# Altium project 5DPD8_OS.PrjPcb (part 1 of 2)
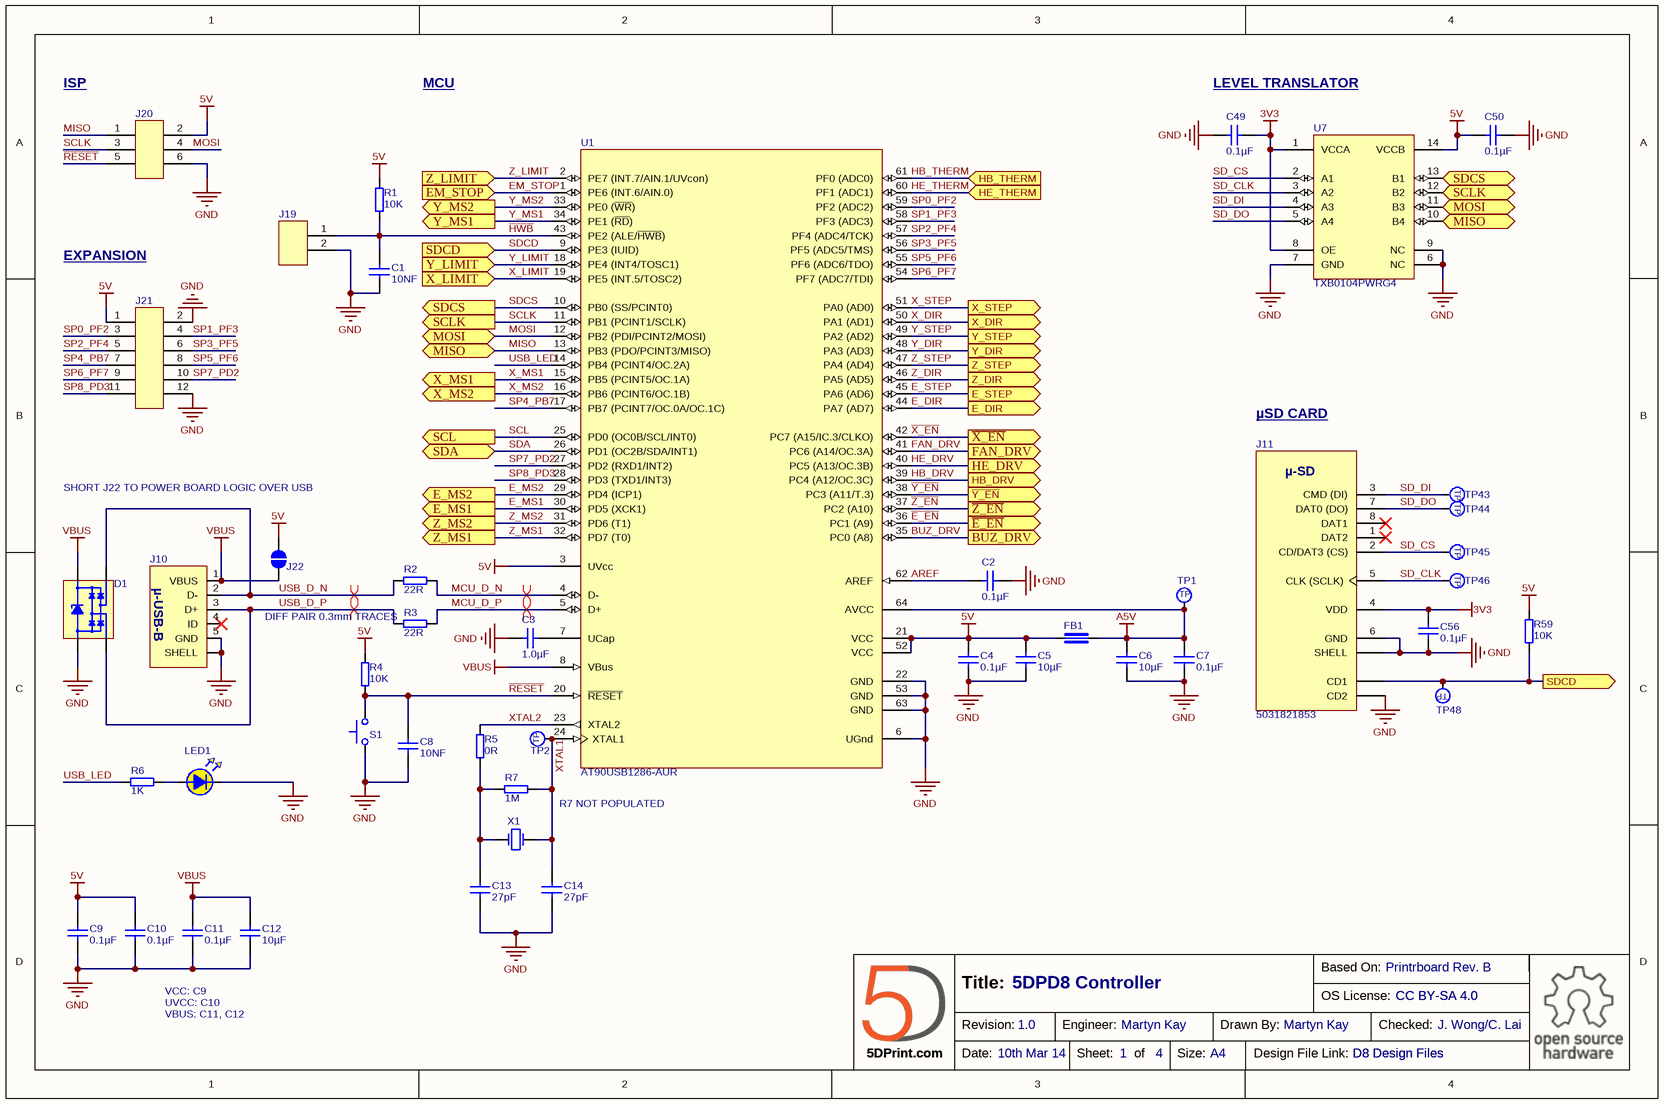
[diagram p0: 5DPD8_v1.0_OS_Sheet1.SchDoc]
4 sheets, 240 parts. Net scope: flat (ports and power ports of the same name join across sheets).
Board file: 5DPD8_v1.0_OS.PcbDoc
Sheets:
  5DPD8_v1.0_OS_Sheet1.SchDoc
  5DPD8_v1.0_OS_Sheet2.SchDoc
  5DPD8_v1.0_OS_Sheet3.SchDoc
  5DPD8_v1.0_OS_Sheet4.SchDoc

## Sheet 5DPD8_v1.0_OS_Sheet1.SchDoc: 5DPD8 Controller
size A4; Date: 10th Mar 14; CheckedBy: J. Wong/C. Lai; CompanyName: Makible Ltd.; DrawnBy: Martyn Kay; Engineer: Martyn Kay; Revision: 1.0; SheetNumber: 1; SheetTotal: 4; Website: 5DPrint.com; DesignFileLink: D8 Design Files; BasedOn: Printrboard Rev. B; OSHWLicense: CC BY-SA 4.0

### Parts
C1  10NF  [CAPC0603(1608)100_N]
C2  0.1µF  [CAPC0603(1608)100_N]
C3  1.0µF  [CAPC0603(1608)100_N]
C4  0.1µF  [CAPC0603(1608)100_N]
C5  10µF  [CAPC0603(1608)100_N]
C6  10µF  [CAPC0603(1608)100_N]
C7  0.1µF  [CAPC0603(1608)100_N]
C8  10NF  [CAPC0603(1608)100_N]
C9  0.1µF  [CAPC0603(1608)100_N]
C10  0.1µF  [CAPC0603(1608)100_N]
C11  0.1µF  [CAPC0603(1608)100_N]
C12  10µF  [CAPC0603(1608)100_N]
C13  27pF  [CAPC0603(1608)100_N]
C14  27pF  [CAPC0603(1608)100_N]
C49  0.1µF  [CAPC0603(1608)100_N]
C50  0.1µF  [CAPC0603(1608)100_N]
C56  0.1µF  [CAPC0603(1608)100_N]
D1  PRTR5V0U2AX,235  [SOT143B(NXP)]  (value not drawn)
FB1  MMZ1608R301A  [INDC0603(1608)_N]  (value not drawn)
J10  10103594-0001LF  [FCI_THT uUSB]  (value not drawn)
J11  5031821853  [MOLEX_503182-1853]
J19  67996-402HLF  [FCI_67996-402HLF]  (value not drawn)
J20  67996-406HLF  [FCI_67996-406HLF]  (value not drawn)
J21  67996-412HLF  [FCI_67996-412HLF]  (value not drawn)
J22  SOLDER JUMPER  [SOLDER_JUMP]  (value not drawn)  (no BOM)
LED1  HSMY-C190  [LEDC0603(1608)_N-YEL]  (value not drawn)
R1  10K  [RESC0603(1608)_N]
R2  22R  [RESC0603(1608)_N]
R3  22R  [RESC0603(1608)_N]
R4  10K  [RESC0603(1608)_N]
R5  0R  [RESC0603(1608)_N]
R6  1K  [RESC0603(1608)_N]
R7  1M  [RESC0603(1608)_N]  (no BOM)
R59  10K  [RESC0603(1608)_N]
S1  PTS810 SJK 250 SMTR LFS  [PTS810]  (value not drawn)
TP1  TESTPOINT  [TESTPOINT]  (value not drawn)  (no BOM)
TP2  TESTPOINT  [TESTPOINT]  (value not drawn)  (no BOM)
TP43  TESTPOINT  [TESTPOINT]  (value not drawn)  (no BOM)
TP44  TESTPOINT  [TESTPOINT]  (value not drawn)  (no BOM)
TP45  TESTPOINT  [TESTPOINT]  (value not drawn)  (no BOM)
TP46  TESTPOINT  [TESTPOINT]  (value not drawn)  (no BOM)
TP48  TESTPOINT  [TESTPOINT]  (value not drawn)  (no BOM)
U1  AT90USB1286-AUR  [QFP80P1600X1600X120-64_N]
U7  TXB0104PWRG4  [TI-PW14_N]
X1  ABLS-16.000MHZ-K4T  [HC-49US]  (value not drawn)

### Ports
BUZ_DRV (out), E_DIR (out), E_MS1 (out), E_MS2 (out), E_STEP (out), EM_STOP (in), FAN_DRV (out), HB_DRV (out), HB_THERM (in), HE_DRV (out), HE_THERM (in), MISO (bidir), MOSI (bidir), SCL (out), SCLK (in), SCLK (out), SDA (bidir), SDCD (in), SDCD (out), SDCS (in), SDCS (out), X_DIR (out), X_LIMIT (in), X_MS1 (out), X_MS2 (out), X_STEP (out), Y_DIR (out), Y_LIMIT (in), Y_MS1 (out), Y_MS2 (out), Y_STEP (out), Z_DIR (out), Z_LIMIT (in), Z_MS1 (out), Z_MS2 (out), Z_STEP (out), ~{E_EN} (out), ~{X_EN} (out), ~{Y_EN} (out), ~{Z_EN} (out)

### Nets
3V3: C49.2 C56.2 J11.4(VDD) U7.1(VCCA) U7.8(OE)
5V: C4.2 C5.2 C9.2 C10.2 C50.1 FB1.1 J20.2 J21.1 J22.2 R1.2 R4.2 R59.2 U1.3(UVcc) U1.21(VCC) U1.52(VCC) U7.14(VCCB)
A5V: C6.2 C7.2 FB1.2 TP1.1 U1.64(AVCC)
GND: C1.1 C2.2 C3.1 C4.1 C5.1 C6.1 C7.1 C8.1 C9.1 C10.1 C11.1 C12.1 C13.1 C14.1 C49.1 C50.2 C56.1 D1.1(GND) J10.5(GND) J10.M(SHELL) J11.6(GND) J11.CD2 J11.M(SHELL) J19.2 J20.6 J21.2 J21.12 LED1.K S1.1 U1.6(UGnd) U1.22(GND) U1.53(GND) U1.63(GND) U7.6(NC) U7.7(GND) U7.9(NC)
VBUS: C11.2 C12.2 D1.4(VBUS) J10.1(VBUS) J22.1 U1.8(VBus)
AREF: C2.1 U1.62(AREF)
BUZ_DRV: U1.35(PC0_(A8)) ; port BUZ_DRV
~{E_EN}: U1.36(PC1_(A9)) ; port ~{E_EN}
E_DIR: U1.44(PA7_(AD7)) ; port E_DIR
E_MS1: U1.30(PD5_(XCK1)) ; port E_MS1
E_MS2: U1.29(PD4_(ICP1)) ; port E_MS2
E_STEP: U1.45(PA6_(AD6)) ; port E_STEP
EM_STOP: U1.1(PE6_(INT.6/AIN.0)) ; port EM_STOP
FAN_DRV: U1.41(PC6_(A14/OC.3A)) ; port FAN_DRV
~{HWB}: C1.2 J19.1 R1.1 U1.43(PE2_(ALE/~{HWB}))
HB_DRV: U1.39(PC4_(A12/OC.3C)) ; port HB_DRV
HB_THERM: U1.61(PF0_(ADC0)) ; port HB_THERM
HE_DRV: U1.40(PC5_(A13/OC.3B)) ; port HE_DRV
HE_THERM: U1.60(PF1_(ADC1)) ; port HE_THERM
MCU_D_N: R2.2 U1.4(D-)
MCU_D_P: R3.2 U1.5(D+)
MISO: J20.1 U1.13(PB3_(PDO/PCINT3/MISO)) U7.10(B4) ; port MISO
MOSI: J20.4 U1.12(PB2_(PDI/PCINT2/MOSI)) U7.11(B3) ; port MOSI
~{RESET}: C8.2 J20.5 R4.1 S1.3 U1.20(~{RESET})
SCL: U1.25(PD0_(OC0B/SCL/INT0)) ; port SCL
SCLK: J20.3 U1.11(PB1_(PCINT1/SCLK)) U7.12(B2) ; port SCLK
SD_CLK: J11.5(CLK_(SCLK)) TP46.1 U7.3(A2)
SD_CS: J11.2(CD/DAT3_(CS)) TP45.1 U7.2(A1)
SD_DI: J11.3(CMD_(DI)) TP43.1 U7.4(A3)
SD_DO: J11.7(DAT0_(DO)) TP44.1 U7.5(A4)
SDA: U1.26(PD1_(OC2B/SDA/INT1)) ; port SDA
SDCD: J11.CD1 R59.1 TP48.1 U1.9(PE3_(IUID)) ; port SDCD
SDCS: U1.10(PB0_(SS/PCINT0)) U7.13(B1) ; port SDCS
SP0_PF2: J21.3 U1.59(PF2_(ADC2))
SP1_PF3: J21.4 U1.58(PF3_(ADC3))
SP2_PF4: J21.5 U1.57(PF4_(ADC4/TCK))
SP3_PF5: J21.6 U1.56(PF5_(ADC5/TMS))
SP4_PB7: J21.7 U1.17(PB7_(PCINT7/OC.0A/OC.1C))
SP5_PF6: J21.8 U1.55(PF6_(ADC6/TDO))
SP6_PF7: J21.9 U1.54(PF7_(ADC7/TDI))
SP7_PD2: J21.10 U1.27(PD2_(RXD1/INT2))
SP8_PD3: J21.11 U1.28(PD3_(TXD1/INT3))
USB_D_N: D1.3(P2) J10.2(D-) R2.1
USB_D_P: D1.2(P1) J10.3(D+) R3.1
USB_LED: R6.1 U1.14(PB4_(PCINT4/OC.2A))
~{X_EN}: U1.42(PC7_(A15/IC.3/CLKO)) ; port ~{X_EN}
X_DIR: U1.50(PA1_(AD1)) ; port X_DIR
X_LIMIT: U1.19(PE5_(INT.5/TOSC2)) ; port X_LIMIT
X_MS1: U1.15(PB5_(PCINT5/OC.1A)) ; port X_MS1
X_MS2: U1.16(PB6_(PCINT6/OC.1B)) ; port X_MS2
X_STEP: U1.51(PA0_(AD0)) ; port X_STEP
XTAL1: C14.2 R7.2 TP2.1 U1.24(XTAL1) X1.2(OSC2)
XTAL2: R5.2 U1.23(XTAL2)
~{Y_EN}: U1.38(PC3_(A11/T.3)) ; port ~{Y_EN}
Y_DIR: U1.48(PA3_(AD3)) ; port Y_DIR
Y_LIMIT: U1.18(PE4_(INT4/TOSC1)) ; port Y_LIMIT
Y_MS1: U1.34(PE1_(~{RD})) ; port Y_MS1
Y_MS2: U1.33(PE0_(~{WR})) ; port Y_MS2
Y_STEP: U1.49(PA2_(AD2)) ; port Y_STEP
~{Z_EN}: U1.37(PC2_(A10)) ; port ~{Z_EN}
Z_DIR: U1.46(PA5_(AD5)) ; port Z_DIR
Z_LIMIT: U1.2(PE7_(INT.7/AIN.1/UVcon)) ; port Z_LIMIT
Z_MS1: U1.32(PD7_(T0)) ; port Z_MS1
Z_MS2: U1.31(PD6_(T1)) ; port Z_MS2
Z_STEP: U1.47(PA4_(AD4)) ; port Z_STEP
NetC3_2: C3.2 U1.7(UCap)
NetC13_2: C13.2 R5.1 R7.1 X1.1(OSC1)
NetLED1_A: LED1.A R6.2

Not connected (* = marked no-connect by the designer): J10 4(ID)*; J11 1(DAT2)* 8(DAT1)*; S1 2 4

### Layout directives
differential pair: MCU_D_N, MCU_D_P, USB_D_N, USB_D_P

### Notes on the sheet
- ISP
- MCU
- LEVEL TRANSLATOR
- EXPANSION
- µSD CARD
- SHORT J22 TO POWER BOARD LOGIC OVER USB
- DIFF PAIR 0.3mm TRACES
- R7 NOT POPULATED
- VCC: C9
  UVCC: C10
  VBUS: C11, C12
- Based On:
- Title:
- Revision:
- Engineer:
- Drawn By:
- OS License:
- Checked:
- Date:
- Sheet:
- of
- Size:
- A4
- Design File Link:
- (in symbol CON_FCI_10103594-0001LF) µ-USB-B
- (in symbol CON_MLX_503182-1853) µ-SD
- (in symbol TESTPOINT) TP

### Library data of the parts
C1 C8 = C0603-10NF-50V-10%-X7R: CAP CER 10000PF 50V 10% X7R 0603; Manufacturer: Yageo; ManufacturerPartNumber: CC0603KPX7R9BB103; Supplier 1: Digi-Key; RoHS: RoHS Compliant; Category: Capacitors; Stock 1: 15000; Pricing 1: 15000=0.003, 30000=0.00285, 75000=0.00255, 105000=0.00206 (USD); Packaging: Tape & Reel (TR); Capacitance: 10NF; Voltage - Rated: 50V; Tolerance: ±10%; Temperature Coefficient: X7R; Mounting Type: Surface Mount, MLCC; Operating Temperature: -55°C ~ 125°C; Applications: General Purpose; Ratings: -; Package / Case: 0603 (1608 Metric); Size / Dimension: 0.063" L x 0.031" W (1.60mm x 0.80mm); Height - Seated (Max): -; Thickness (Max): 0.035" (0.90mm); Lead Spacing: -; Features: -; Lead Style: -; ComponentLink1URL: http://www.yageo.com/documents/recent/UPY-GPHC_X7R_6.3V-to-50V_8.pdf; ComponentLink1Description: http://www.yageo.com/documents/recent/UPY-GPHC_X7R_6.3V-to-50V_8.pdf; Supplier Part Number 1: 311-1572-2-ND
C2 C4 C7 C9-C11 C49 C50 C56 = C0603-0.1UF-50V-10%-X7R: CAP CER 0.1UF 50V 10% X7R 0603; Manufacturer: Yageo; ManufacturerPartNumber: CC0603KRX7R9BB104; Supplier 1: Digi-Key; RoHS: RoHS Compliant; Category: Capacitors; Stock 1: 2096000; Pricing 1: 4000=0.00513, 8000=0.00468, 12000=0.00446, 28000=0.00424, 100000=0.00307 (USD); Packaging: Tape & Reel (TR); Capacitance: 0.1µF; Voltage - Rated: 50V; Tolerance: ±10%; Temperature Coefficient: X7R; Mounting Type: Surface Mount, MLCC; Operating Temperature: -55°C ~ 125°C; Applications: General Purpose; Ratings: -; Package / Case: 0603 (1608 Metric); Size / Dimension: 0.063" L x 0.031" W (1.60mm x 0.80mm); Height - Seated (Max): -; Thickness (Max): 0.035" (0.90mm); Lead Spacing: -; Features: -; Lead Style: -; ComponentLink1URL: http://www.yageo.com/documents/recent/UPY-GPHC_X7R_6.3V-to-50V_8.pdf; ComponentLink1Description: http://www.yageo.com/documents/recent/UPY-GPHC_X7R_6.3V-to-50V_8.pdf; Supplier Part Number 1: 311-1344-2-ND
C3 = C0603-1UF-10V-10%-X7R: CAP CER 1UF 10V 10% X7R 0603; Manufacturer: Taiyo Yuden; ManufacturerPartNumber: LMK107B7105KA-T; Supplier 1: Digi-Key; RoHS: RoHS Compliant; Category: Capacitors; Stock 1: 116000; Pricing 1: 4000=0.00782, 8000=0.00714, 12000=0.0068, 28000=0.00646 (USD); Packaging: Tape & Reel (TR); Capacitance: 1.0µF; Voltage - Rated: 10V; Tolerance: ±10%; Temperature Coefficient: X7R; Mounting Type: Surface Mount, MLCC; Operating Temperature: -55°C ~ 125°C; Applications: General Purpose; Ratings: -; Package / Case: 0603 (1608 Metric); Size / Dimension: 0.063" L x 0.031" W (1.60mm x 0.80mm); Height - Seated (Max): -; Thickness (Max): 0.035" (0.90mm); Lead Spacing: -; Features: -; Lead Style: -; ComponentLink1URL: http://www.yuden.co.jp/or/product/category/capacitor/LMK107B7105KA-T.pdf; ComponentLink1Description: http://www.yuden.co.jp/or/product/category/capacitor/LMK107B7105KA-T.pdf; Supplier Part Number 1: 587-1242-2-ND
C5 C6 C12 = C0603-10UF-10V-10%-X5R: CAP CER 10UF 10V 10% X5R 0603; Manufacturer: TDK Corporation; ManufacturerPartNumber: C1608X5R1A106K080AC; Supplier 1: Digi-Key; RoHS: RoHS Compliant; Category: Capacitors; Stock 1: 316000; Pricing 1: 4000=0.102, 8000=0.096, 12000=0.093, 28000=0.09, 100000=0.078 (USD); Packaging: Tape & Reel (TR); Capacitance: 10µF; Voltage - Rated: 10V; Tolerance: ±10%; Temperature Coefficient: X5R; Mounting Type: Surface Mount, MLCC; Operating Temperature: -55°C ~ 85°C; Applications: General Purpose; Ratings: -; Package / Case: 0603 (1608 Metric); Size / Dimension: 0.063" L x 0.031" W (1.60mm x 0.80mm); Height - Seated (Max): -; Thickness (Max): 0.035" (0.90mm); Lead Spacing: -; Features: -; Lead Style: -; ComponentLink1URL: http://product.tdk.com/capacitor/mlcc/en/documents/mlcc_commercial_general_en.pdf; ComponentLink1Description: http://product.tdk.com/capacitor/mlcc/en/documents/mlcc_commercial_general_en.pdf; Supplier Part Number 1: 445-7486-2-ND
C13 C14 = C0603-27PF-50V-1%-NP0: CAP CER 27PF 50V 1% NP0 0603; Manufacturer: Murata Electronics North America; ManufacturerPartNumber: GRM1885C1H270FA01D; Temperature Coefficient: C0G, NP0; Supplier 1: Digi-Key; RoHS: RoHS Compliant; Category: Capacitors; Stock 1: 0; Pricing 1: 16000=0.02109 (USD); Packaging: Tape & Reel (TR); Capacitance: 27pF; Voltage - Rated: 50V; Tolerance: ±1%; Mounting Type: Surface Mount, MLCC; Operating Temperature: -55°C ~ 125°C; Applications: General Purpose; Ratings: -; Package / Case: 0603 (1608 Metric); Size / Dimension: 0.063" L x 0.031" W (1.60mm x 0.80mm); Height - Seated (Max): -; Thickness (Max): 0.035" (0.90mm); Lead Spacing: -; Features: -; Lead Style: -; ComponentLink1URL: http://www.murata.com/products/catalog/pdf/c02e.pdf; ComponentLink1Description: http://www.murata.com/products/catalog/pdf/c02e.pdf; Supplier Part Number 1: GRM1885C1H270FA01D-ND
D1 = DIO_PRTR5V0U2AX,235: DIODE ESD PROTECT 5.5V SOT143B; Manufacturer: NXP Semiconductors; Voltage - Breakdown: 6V; Polarization: 2 Channel Array - Bidirectional; Supplier 1: Digi-Key; ManufacturerPartNumber: PRTR5V0U2AX,235; RoHS: RoHS Compliant; Category: Circuit Protection; Stock 1: 0; Pricing 1: 10000=0.15876, 30000=0.15053, 50000=0.147, 100000=0.14465, 250000=0.14112 (USD); Packaging: Tape & Reel (TR); Voltage - Reverse Standoff (Typ): 5.5V; Power (Watts): -; Mounting Type: Surface Mount; Package / Case: TO-253-4, TO-253AA; Supplier Device Package: SOT-143B; ComponentLink1URL: http://www.nxp.com/documents/data_sheet/PRTR5V0U2AX.pdf; ComponentLink1Description: http://www.nxp.com/documents/data_sheet/PRTR5V0U2AX.pdf; Supplier Part Number 1: 568-7445-2-ND
FB1 = MAG_MMZ1608R301A: FERRITE CHIP 300 OHM 500MA 0603; Manufacturer: TDK Corporation; Impedance @ Frequency: 300 Ohm @ 100MHz; DC Resistance (DCR): 250 mOhm Max; Filter Type: Differential Mode - Single; Supplier 1: Digi-Key; ManufacturerPartNumber: MMZ1608R301A; RoHS: RoHS Compliant; Category: Filters; Stock 1: 176000; Pricing 1: 4000=0.0192, 8000=0.0174, 12000=0.0168, 28000=0.0156, 100000=0.01542 (USD); Packaging: Tape & Reel (TR); Current Rating: 500mA; Package / Case: 0603 (1608 Metric); Mounting Type: Surface Mount; Height (Max): 0.037" (0.95mm); Size / Dimension: 0.063" L x 0.031" W (1.60mm x 0.80mm); ComponentLink1URL: http://www.tdk.co.jp/tefe02/e9412_mmz.pdf; ComponentLink1Description: http://www.tdk.co.jp/tefe02/e9412_mmz.pdf; Supplier Part Number 1: 445-2171-2-ND
J10 = CON_FCI_10103594-0001LF: CONN RCPT STD MICRO USB TYPE B; Manufacturer: FCI; Connector Type: USB - micro B; Number of Contacts: 5; Gender: Receptacle; Specifications: USB 2.0; Supplier 1: Digi-Key; ManufacturerPartNumber: 10103594-0001LF; RoHS: RoHS Compliant; Category: Connectors, Interconnects; Stock 1: 6000; Pricing 1: 1500=0.32896, 3000=0.3084, 7500=0.29812, 10500=0.27756, 15000=0.27345, 37500=0.26728 (USD); Packaging: Tape & Reel (TR); Mounting Type: Surface Mount, Right Angle, Horizontal; Features: Shielded, Solder Retention; Ingress Protection: -; ComponentLink1URL: http://portal.fciconnect.com/Comergent//fci/drawing/10103594.pdf; ComponentLink1Description: http://portal.fciconnect.com/Comergent//fci/drawing/10103594.pdf; Supplier Part Number 1: 609-4050-2-ND
J11 = CON_MLX_503182-1853: CONN MICRO SD MEMORY CARD 8CKT; Manufacturer: Molex Inc; Card Type: Secure Digital - microSD™; Number of Positions: 10 (8 + 2); Connector Type: Connector and Ejector; Insertion, Removal Method: Push In, Push Out; Supplier 1: Digi-Key; ManufacturerPartNumber: 5031821853; RoHS: RoHS Compliant; Category: Connectors, Interconnects; Stock 1: 0; Pricing 1: 1600=0.90074, 3200=0.86968, 4800=0.8262, 8000=0.80756 (USD); Packaging: Tape & Reel (TR); Ejector Side: -; Mounting Type: Surface Mount, Right Angle; Features: Switch; Height Above Board: 0.057" (1.45mm); Mounting Feature: Normal, Standard - Top; Contact Finish: Gold; Contact Finish Thickness: -; ComponentLink1URL: http://www.molex.com/pdm_docs/sd/5031821853_sd.pdf; ComponentLink1Description: http://www.molex.com/pdm_docs/sd/5031821853_sd.pdf; Supplier Part Number 1: WM9750TR-ND
J19 = CON_FCI_67996-402HLF: CONN HEADER 2POS .100 STR TIN; Manufacturer: FCI; Current Rating: 3 A; Mounting Angle: Vertical; Voltage Rating: 1.5 kV; Pitch: 2.54 mm; Insulation Resistance: 5000 MOhms; Mating Post Length: 5.84 mm; Number of Positions / Contacts: 2; Supplier 1: Mouser; ManufacturerPartNumber: 67996-402HLF; RoHS: RoHS Compliant; Category: Headers & Wire Housings; Stock 1: 3589; Pricing 1: 1=0.120, 10=0.092, 100=0.077, 500=0.064, 1000=0.055, 2500=0.049, 5000=0.048, 10000=0.047 (USD); Contact Plating: Tin; Housing Material: Thermoplastic; Number of Rows: 2; Packaging: Bulk; Series: BergStik; Termination Style: Through Hole; Type: Unshrouded; Contact Material: Phosphor Bronze; Mounting Style: -; Row Spacing: 2.54 mm; Contact Gender: Pin (Male); Product Category: Bergstik Headers; Product Type: Headers; Standard Pack Qty: 2000; Termination Post Length: 2.41 mm; RoHS - Mouser: Y; Minimum Order Quantity: 1; Reeling: False; ComponentLink1URL: http://portal.fciconnect.com/Comergent/fci/drawing/67996.pdf; ComponentLink1Description: http://portal.fciconnect.com/Comergent/fci/drawing/67996.pdf; Supplier Part Number 1: 649-67996-402HLF
J20 = CON_FCI_67996-406HLF: CONN HEADER 6POS .100 STR TIN; Manufacturer: FCI; Connector Type: Header, Unshrouded; Number of Positions: 6; Number of Positions Loaded: All; Pitch: 0.100" (2.54mm); Supplier 1: Digi-Key; ManufacturerPartNumber: 67996-406HLF; RoHS: RoHS Compliant; Category: Connectors, Interconnects; Stock 1: 6000; Pricing 1: 1=0.26, 10=0.249, 25=0.2132, 50=0.1814, 100=0.1742, 250=0.15644, 500=0.14932, 1000=0.12443, 2500=0.11376 (USD); Packaging: Bulk; Contact Type: Male Pin; Number of Rows: 2; Row Spacing: 0.100" (2.54mm); Contact Mating Length: 0.230" (5.84mm); Mounting Type: Through Hole; Termination: Solder; Fastening Type: -; Features: -; Contact Finish: Tin; Contact Finish Thickness: 100µin (2.54µm); Color: Black; ComponentLink1URL: http://portal.fciconnect.com/Comergent//fci/drawing/67996.pdf; ComponentLink1Description: http://portal.fciconnect.com/Comergent//fci/drawing/67996.pdf; Supplier Part Number 1: 609-3218-ND
J21 = CON_FCI_67996-412HLF: CONN HEADER 12POS .100 STR TIN; Manufacturer: FCI; Connector Type: Header, Unshrouded; Number of Positions: 12; Number of Positions Loaded: All; Pitch: 0.100" (2.54mm); Supplier 1: Digi-Key; ManufacturerPartNumber: 67996-412HLF; RoHS: RoHS Compliant; Category: Connectors, Interconnects; Stock 1: 1651; Pricing 1: 1=0.4, 10=0.379, 25=0.3248, 50=0.276, 100=0.2651, 250=0.23804, 500=0.22722, 1000=0.18935, 2500=0.17312 (USD); Packaging: Bulk; Contact Type: Male Pin; Number of Rows: 2; Row Spacing: 0.100" (2.54mm); Contact Mating Length: 0.230" (5.84mm); Mounting Type: Through Hole; Termination: Solder; Fastening Type: -; Features: -; Contact Finish: Tin; Contact Finish Thickness: 100µin (2.54µm); Color: Black; ComponentLink1URL: http://portal.fciconnect.com/Comergent//fci/drawing/67996.pdf; ComponentLink1Description: http://portal.fciconnect.com/Comergent//fci/drawing/67996.pdf; Supplier Part Number 1: 609-3219-ND
J22 = CON_SOLDER_JUMP
LED1 = LED_HSMY-C190: LED 589NM YELLOW DIFF 0603 SMD; Manufacturer: Avago Technologies US Inc.; Wavelength - Dominant: 586nm; Millicandela Rating: 8mcd; Voltage - Forward (Vf) Typ: 2.1V; Current - Test: 20mA; Viewing Angle: 170°; Lens Type: Diffused; Lens Style/Size: Rectangle with Flat Top, 1mm x 0.8mm; Supplier 1: Digi-Key; ManufacturerPartNumber: HSMY-C190; RoHS: RoHS Compliant; Category: Optoelectronics; Stock 1: 12000; Pricing 1: 4000=0.08, 8000=0.072, 12000=0.064, 28000=0.06, 100000=0.052 (USD); Packaging: Tape & Reel (TR); Color: Yellow; Wavelength - Peak: 589nm; Package / Case: 0603 (1608 Metric); Size / Dimension: 1.60mm L x 0.80mm W; Height: 0.80mm; Mounting Type: Surface Mount; Luminous Flux @ Current - Test: -; ComponentLink1URL: http://www.avagotech.com/docs/AV02-0551EN; ComponentLink1Description: http://www.avagotech.com/docs/AV02-0551EN; Supplier Part Number 1: 516-1424-2-ND
R1 R4 R59 = R0603-10K-0.1W-5%: RES 10K OHM 1/10W 5% 0603 SMD; Manufacturer: Yageo; ManufacturerPartNumber: RC0603JR-0710KL; Power (Watts): 0.1W, 1/10W; Temperature Coefficient: ±100ppm/°C; Supplier 1: Digi-Key; RoHS: RoHS Compliant; Category: Resistors; Stock 1: 0; Pricing 1: 5000=0.00131, 10000=0.00114, 25000=0.001, 50000=0.00092, 125000=0.0009 (USD); Packaging: Tape & Reel (TR); Resistance: 10K; Tolerance: ±5%; Composition: Thick Film; Features: -; Package / Case: 0603 (1608 Metric); Supplier Device Package: 0603; Size / Dimension: 0.063" L x 0.031" W (1.60mm x 0.80mm); Height: 0.022" (0.55mm); Number of Terminations: 2; ComponentLink1URL: http://www.yageo.com/documents/recent/PYu-RC0603_51_RoHS_L_4.pdf; ComponentLink1Description: http://www.yageo.com/documents/recent/PYu-RC0603_51_RoHS_L_4.pdf; Supplier Part Number 1: 311-10KGRTR-ND
R2 R3 = R0603-22R-0.1W-1%: RES 22.0 OHM 1/10W 1% 0603 SMD; Manufacturer: Yageo; ManufacturerPartNumber: RC0603FR-0722RL; Power (Watts): 0.1W, 1/10W; Temperature Coefficient: ±100ppm/°C; Supplier 1: Digi-Key; RoHS: RoHS Compliant; Category: Resistors; Stock 1: 45000; Pricing 1: 5000=0.00171, 10000=0.00149, 25000=0.00131, 50000=0.0012, 125000=0.00117 (USD); Packaging: Tape & Reel (TR); Resistance: 22R; Tolerance: ±1%; Composition: Thick Film; Features: -; Package / Case: 0603 (1608 Metric); Supplier Device Package: 0603; Size / Dimension: 0.063" L x 0.031" W (1.60mm x 0.80mm); Height: 0.022" (0.55mm); Number of Terminations: 2; ComponentLink1URL: http://www.yageo.com/documents/recent/PYu-RC0603_51_RoHS_L_4.pdf; ComponentLink1Description: http://www.yageo.com/documents/recent/PYu-RC0603_51_RoHS_L_4.pdf; Supplier Part Number 1: 311-22.0HRTR-ND
R5 = R0603-0R-0.1W-JUMP: RES ZERO OHM 1/10W JUMP 0603 SMD; Manufacturer: Yageo; ManufacturerPartNumber: RC0603JR-070RL; Tolerance: Jumper; Power (Watts): 0.1W, 1/10W; Supplier 1: Digi-Key; RoHS: RoHS Compliant; Category: Resistors; Stock 1: 2065000; Pricing 1: 5000=0.00131, 10000=0.00114, 25000=0.001, 50000=0.00092, 125000=0.0009 (USD); Packaging: Tape & Reel (TR); Resistance: 0R; Composition: Thick Film; Features: -; Temperature Coefficient: -; Package / Case: 0603 (1608 Metric); Supplier Device Package: 0603; Size / Dimension: 0.063" L x 0.031" W (1.60mm x 0.80mm); Height: 0.022" (0.55mm); Number of Terminations: 2; ComponentLink1URL: http://www.yageo.com/documents/recent/PYu-RC0603_51_RoHS_L_4.pdf; ComponentLink1Description: http://www.yageo.com/documents/recent/PYu-RC0603_51_RoHS_L_4.pdf; Supplier Part Number 1: 311-0.0GRTR-ND
R6 = R0603-1K-0.1W-1%: RES 1.00K OHM 1/10W 1% 0603 SMD; Manufacturer: Yageo; ManufacturerPartNumber: RC0603FR-071KL; Power (Watts): 0.1W, 1/10W; Temperature Coefficient: ±100ppm/°C; Supplier 1: Digi-Key; RoHS: RoHS Compliant; Category: Resistors; Stock 1: 1620000; Pricing 1: 5000=0.00171, 10000=0.00149, 25000=0.00131, 50000=0.0012, 125000=0.00117 (USD); Packaging: Tape & Reel (TR); Resistance: 1K; Tolerance: ±1%; Composition: Thick Film; Features: -; Package / Case: 0603 (1608 Metric); Supplier Device Package: 0603; Size / Dimension: 0.063" L x 0.031" W (1.60mm x 0.80mm); Height: 0.022" (0.55mm); Number of Terminations: 2; ComponentLink1URL: http://www.yageo.com/documents/recent/PYu-RC0603_51_RoHS_L_4.pdf; ComponentLink1Description: http://www.yageo.com/documents/recent/PYu-RC0603_51_RoHS_L_4.pdf; Supplier Part Number 1: 311-1.00KHRTR-ND
R7 = R0603-1M-0.1W-1%: RES 1.00M OHM 1/10W 1% 0603 SMD; Manufacturer: Yageo; ManufacturerPartNumber: RC0603FR-071ML; Power (Watts): 0.1W, 1/10W; Temperature Coefficient: ±100ppm/°C; Supplier 1: Digi-Key; RoHS: RoHS Compliant; Category: Resistors; Stock 1: 1300000; Pricing 1: 5000=0.00171, 10000=0.00149, 25000=0.00131, 50000=0.0012, 125000=0.00117 (USD); Packaging: Tape & Reel (TR); Resistance: 1M; Tolerance: ±1%; Composition: Thick Film; Features: -; Package / Case: 0603 (1608 Metric); Supplier Device Package: 0603; Size / Dimension: 0.063" L x 0.031" W (1.60mm x 0.80mm); Height: 0.022" (0.55mm); Number of Terminations: 2; ComponentLink1URL: http://www.yageo.com/documents/recent/PYu-RC0603_51_RoHS_L_4.pdf; ComponentLink1Description: http://www.yageo.com/documents/recent/PYu-RC0603_51_RoHS_L_4.pdf; Supplier Part Number 1: 311-1.00MHRTR-ND
S1 = SW_PTS810 SJK 250 SMTR LFS: SWITCH TACTILE SPST-NO 0.05A 16V; Manufacturer: C&K Components; Switch Function: Off-Mom; Contact Rating @ Voltage: 0.05A @ 16VDC; Actuator Type: Standard; Actuator Height off PCB, from Pins: 2.50mm; Actuator Orientation: Top Actuated; Outline: 4.20mm x 3.20mm; Illumination: Non-Illuminated; Operating Force: 260gf; Switch Travel: 0.15mm; Mechanical Life: 50,000 Cycles; Supplier 1: Digi-Key; ManufacturerPartNumber: PTS810 SJK 250 SMTR LFS; RoHS: RoHS Compliant; Category: Switches; Stock 1: 14500; Pricing 1: 2900=0.147, 5800=0.1218 (USD); Packaging: Tape & Reel (TR); Circuit: SPST-NO; Mounting Type: Surface Mount; Termination Style: J Lead; Illumination Voltage (Nominal): -; Illumination Type, Color: -; Ingress Protection: -; Features: -; Actuator Material: -; Operating Temperature: -40°C ~ 85°C; ComponentLink1URL: http://www.ck-components.com/80183/pts810_4mar13.pdf/; ComponentLink1Description: http://www.ck-components.com/80183/pts810_4mar13.pdf/; Supplier Part Number 1: CKN10503TR-ND
U1 = IC_AT90USB1286-AUR: IC MCU 8BIT 128KB FLASH 64TQFP; Manufacturer: Atmel; Core Processor: AVR; Core Size: 8-Bit; Speed: 16MHz; Connectivity: EBI/EMI, I²C, SPI, UART/USART, USB, USB OTG; Peripherals: Brown-out Detect/Reset, POR, PWM, WDT; Number of I /O: 48; Program Memory Size: 128KB (128K x 8); EEPROM Size: 4K x 8; RAM Size: 8K x 8; Voltage - Supply (Vcc/Vdd): 2.7 V ~ 5.5 V; Data Converters: A/D 8x10b; Oscillator Type: Internal; Supplier 1: Digi-Key; ManufacturerPartNumber: AT90USB1286-AUR; RoHS: RoHS Compliant; Category: Integrated Circuits (ICs); Stock 1: 0; Pricing 1: 1000=6.295 (USD); Packaging: Tape & Reel (TR); Program Memory Type: FLASH; Operating Temperature: -40°C ~ 85°C; Package / Case: 64-TQFP; ComponentLink1URL: http://www.atmel.com/Images/7593S.pdf; ComponentLink1Description: http://www.atmel.com/Images/7593S.pdf; Supplier Part Number 1: AT90USB1286-AURTR-ND
U7 = IC_TXB0104PWRG4: IC VOLT-LEVEL TRANSLATOR 14TSSOP; Manufacturer: Texas Instruments; Logic Function: Translator, Bidirectional; Number of Bits: 4; Input Type: Logic; Data Rate: 100Mbps; Number of Outputs/Channel: 1; Differential - Input:Output: No/No; Propagation Delay (Max): 4ns; Voltage - Supply: 1.2 V ~ 3.6 V, 1.65 V ~ 5.5 V; Supplier 1: Digi-Key; ManufacturerPartNumber: TXB0104PWRG4; RoHS: RoHS Compliant; Category: Integrated Circuits (ICs); Stock 1: 0; Pricing 1: 2000=0.6552 (USD); Packaging: Tape & Reel (TR); Output Type: Logic; Number of Channels: 4; Operating Temperature: -40°C ~ 85°C; Package / Case: 14-TSSOP (0.173", 4.40mm Width); Supplier Device Package: 14-TSSOP; Mounting Type: Surface Mount; ComponentLink1URL: http://www.ti.com/lit/ds/symlink/txb0104.pdf; ComponentLink1Description: http://www.ti.com/lit/ds/symlink/txb0104.pdf; Supplier Part Number 1: TXB0104PWRG4-ND
X1 = XTAL_ABLS-16.000MHZ-K4T: CRYSTAL 16MHZ 18PF SMD; Manufacturer: Abracon Corporation; Frequency Stability: ±50ppm; Frequency Tolerance: ±30ppm; ESR (Equivalent Series Resistance): 40 Ohm; Operating Mode: Fundamental; Supplier 1: Digi-Key; ManufacturerPartNumber: ABLS-16.000MHZ-K4T; RoHS: RoHS Compliant; Category: Crystals and Oscillators; Stock 1: 11000; Pricing 1: 1000=0.378, 3000=0.3645, 5000=0.351, 10000=0.3375, 25000=0.324 (USD); Packaging: Tape & Reel (TR); Type: MHz Crystal; Frequency: 16MHz; Load Capacitance: 18pF; Operating Temperature: -40°C ~ 125°C; Ratings: -; Mounting Type: Surface Mount; Package / Case: HC49/US; Size / Dimension: 0.449" L x 0.185" W (11.40mm x 4.70mm); Height: 0.165" (4.20mm); ComponentLink1URL: http://www.abracon.com/Resonators/abls.pdf; ComponentLink1Description: http://www.abracon.com/Resonators/abls.pdf; Supplier Part Number 1: 535-9948-2-ND

## Sheet 5DPD8_v1.0_OS_Sheet2.SchDoc: 5DPD8 Controller
size A4; Date: 10th Mar 14; CheckedBy: J. Wong/C. Lai; CompanyName: Makible Ltd.; DrawnBy: Martyn Kay; Engineer: Martyn Kay; Revision: 1.0; SheetNumber: 2; SheetTotal: 4; Website: 5DPrint.com; DesignFileLink: D8 Design Files; BasedOn: Printrboard Rev. B; OSHWLicense: CC BY-SA 4.0
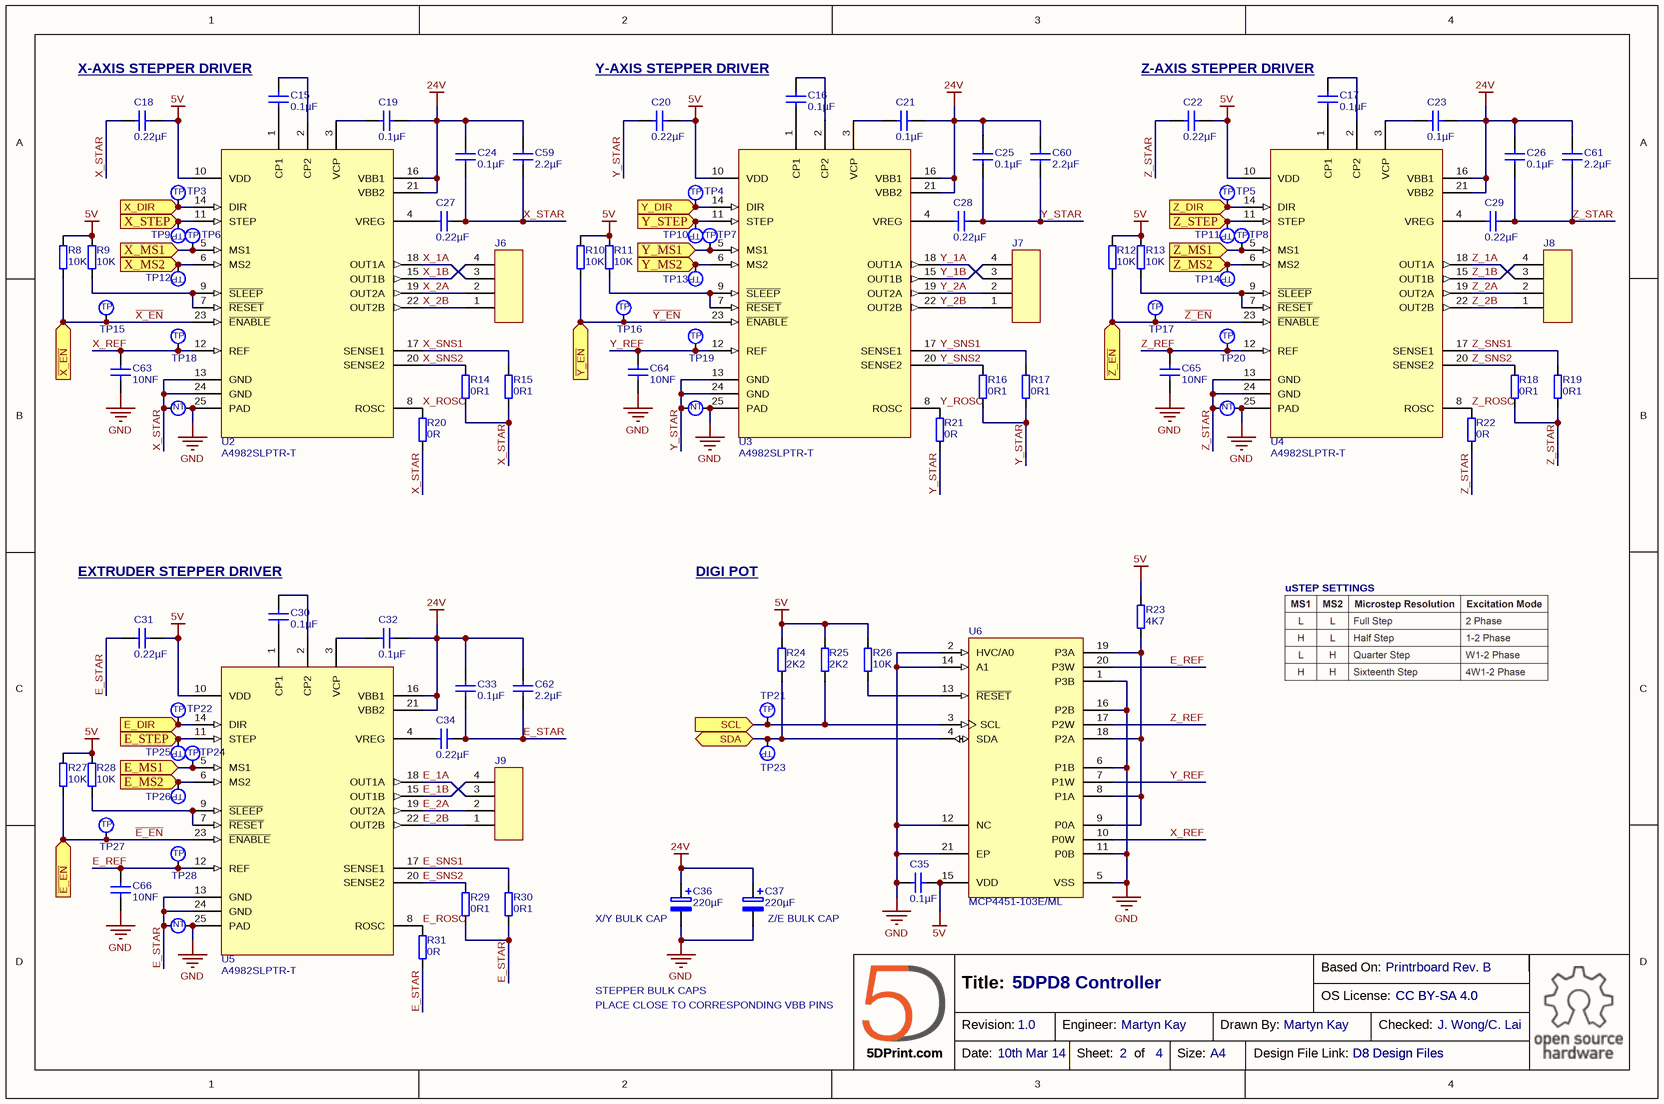
[diagram p1: 5DPD8_v1.0_OS_Sheet2.SchDoc]

### Parts
C15  0.1µF  [CAPC0603(1608)100_N]
C16  0.1µF  [CAPC0603(1608)100_N]
C17  0.1µF  [CAPC0603(1608)100_N]
C18  0.22µF  [CAPC0603(1608)100_N]
C19  0.1µF  [CAPC0603(1608)100_N]
C20  0.22µF  [CAPC0603(1608)100_N]
C21  0.1µF  [CAPC0603(1608)100_N]
C22  0.22µF  [CAPC0603(1608)100_N]
C23  0.1µF  [CAPC0603(1608)100_N]
C24  0.1µF  [CAPC0603(1608)100_N]
C25  0.1µF  [CAPC0603(1608)100_N]
C26  0.1µF  [CAPC0603(1608)100_N]
C27  0.22µF  [CAPC0603(1608)100_N]
C28  0.22µF  [CAPC0603(1608)100_N]
C29  0.22µF  [CAPC0603(1608)100_N]
C30  0.1µF  [CAPC0603(1608)100_N]
C31  0.22µF  [CAPC0603(1608)100_N]
C32  0.1µF  [CAPC0603(1608)100_N]
C33  0.1µF  [CAPC0603(1608)100_N]
C34  0.22µF  [CAPC0603(1608)100_N]
C35  0.1µF  [CAPC0603(1608)100_N]
C36  220µF  [CAPRAD8X11.5]
C37  220µF  [CAPRAD8X11.5]
C59  2.2µF  [CAPC0805(2012)145_N]
C60  2.2µF  [CAPC0805(2012)145_N]
C61  2.2µF  [CAPC0805(2012)145_N]
C62  2.2µF  [CAPC0805(2012)145_N]
C63  10NF  [CAPC0603(1608)100_N]
C64  10NF  [CAPC0603(1608)100_N]
C65  10NF  [CAPC0603(1608)100_N]
C66  10NF  [CAPC0603(1608)100_N]
J6  0022272041  [MOLEX_22-27-2041]  (value not drawn)
J7  0022272041  [MOLEX_22-27-2041]  (value not drawn)
J8  0022272041  [MOLEX_22-27-2041]  (value not drawn)
J9  0022272041  [MOLEX_22-27-2041]  (value not drawn)
NT2  NET_TIE  [NET_TIE-PAD]  (value not drawn)  (net tie, no BOM)
NT3  NET_TIE  [NET_TIE-PAD]  (value not drawn)  (net tie, no BOM)
NT4  NET_TIE  [NET_TIE-PAD]  (value not drawn)  (net tie, no BOM)
NT5  NET_TIE  [NET_TIE-PAD]  (value not drawn)  (net tie, no BOM)
R8  10K  [RESC0603(1608)_N]
R9  10K  [RESC0603(1608)_N]
R10  10K  [RESC0603(1608)_N]
R11  10K  [RESC0603(1608)_N]
R12  10K  [RESC0603(1608)_N]
R13  10K  [RESC0603(1608)_N]
R14  0R1  [RESC0805(2012)_L]
R15  0R1  [RESC0805(2012)_L]
R16  0R1  [RESC0805(2012)_L]
R17  0R1  [RESC0805(2012)_L]
R18  0R1  [RESC0805(2012)_L]
R19  0R1  [RESC0805(2012)_L]
R20  0R  [RESC0603(1608)_N]
R21  0R  [RESC0603(1608)_N]
R22  0R  [RESC0603(1608)_N]
R23  4K7  [RESC0603(1608)_N]
R24  2K2  [RESC0603(1608)_N]
R25  2K2  [RESC0603(1608)_N]
R26  10K  [RESC0603(1608)_N]
R27  10K  [RESC0603(1608)_N]
R28  10K  [RESC0603(1608)_N]
R29  0R1  [RESC0805(2012)_L]
R30  0R1  [RESC0805(2012)_L]
R31  0R  [RESC0603(1608)_N]
TP3  TESTPOINT  [TESTPOINT]  (value not drawn)  (no BOM)
TP4  TESTPOINT  [TESTPOINT]  (value not drawn)  (no BOM)
TP5  TESTPOINT  [TESTPOINT]  (value not drawn)  (no BOM)
TP6  TESTPOINT  [TESTPOINT]  (value not drawn)  (no BOM)
TP7  TESTPOINT  [TESTPOINT]  (value not drawn)  (no BOM)
TP8  TESTPOINT  [TESTPOINT]  (value not drawn)  (no BOM)
TP9  TESTPOINT  [TESTPOINT]  (value not drawn)  (no BOM)
TP10  TESTPOINT  [TESTPOINT]  (value not drawn)  (no BOM)
TP11  TESTPOINT  [TESTPOINT]  (value not drawn)  (no BOM)
TP12  TESTPOINT  [TESTPOINT]  (value not drawn)  (no BOM)
TP13  TESTPOINT  [TESTPOINT]  (value not drawn)  (no BOM)
TP14  TESTPOINT  [TESTPOINT]  (value not drawn)  (no BOM)
TP15  TESTPOINT  [TESTPOINT]  (value not drawn)  (no BOM)
TP16  TESTPOINT  [TESTPOINT]  (value not drawn)  (no BOM)
TP17  TESTPOINT  [TESTPOINT]  (value not drawn)  (no BOM)
TP18  TESTPOINT  [TESTPOINT]  (value not drawn)  (no BOM)
TP19  TESTPOINT  [TESTPOINT]  (value not drawn)  (no BOM)
TP20  TESTPOINT  [TESTPOINT]  (value not drawn)  (no BOM)
TP21  TESTPOINT  [TESTPOINT]  (value not drawn)  (no BOM)
TP22  TESTPOINT  [TESTPOINT]  (value not drawn)  (no BOM)
TP23  TESTPOINT  [TESTPOINT]  (value not drawn)  (no BOM)
TP24  TESTPOINT  [TESTPOINT]  (value not drawn)  (no BOM)
TP25  TESTPOINT  [TESTPOINT]  (value not drawn)  (no BOM)
TP26  TESTPOINT  [TESTPOINT]  (value not drawn)  (no BOM)
TP27  TESTPOINT  [TESTPOINT]  (value not drawn)  (no BOM)
TP28  TESTPOINT  [TESTPOINT]  (value not drawn)  (no BOM)
U2  A4982SLPTR-T  [TSOP65P640X120_HS-25N]
U3  A4982SLPTR-T  [TSOP65P640X120_HS-25N]
U4  A4982SLPTR-T  [TSOP65P640X120_HS-25N]
U5  A4982SLPTR-T  [TSOP65P640X120_HS-25N]
U6  MCP4451-103E/ML  [QFN-ML20_N]

### Ports
E_DIR (in), E_MS1 (in), E_MS2 (in), E_STEP (in), SCL (in), SDA (bidir), X_DIR (in), X_MS1 (in), X_MS2 (in), X_STEP (in), Y_DIR (in), Y_MS1 (in), Y_MS2 (in), Y_STEP (in), Z_DIR (in), Z_MS1 (in), Z_MS2 (in), Z_STEP (in), ~{E_EN} (in), ~{X_EN} (in), ~{Y_EN} (in), ~{Z_EN} (in)

### Nets
5V: C18.2 C20.2 C22.2 C31.2 C35.2 R8.2 R9.2 R10.2 R11.2 R12.2 R13.2 R23.2 R24.2 R25.2 R26.2 R27.2 R28.2 U2.10(VDD) U3.10(VDD) U4.10(VDD) U5.10(VDD) U6.15(VDD)
24V: C19.1 C21.1 C23.1 C24.2 C25.2 C26.2 C32.1 C33.2 C36.1(+) C37.1(+) C59.2 C60.2 C61.2 C62.2 U2.16(VBB1) U2.21(VBB2) U3.16(VBB1) U3.21(VBB2) U4.16(VBB1) U4.21(VBB2) U5.16(VBB1) U5.21(VBB2)
GND: C35.1 C36.2(-) C37.2(-) C63.1 C64.1 C65.1 C66.1 NT2.2 NT3.2 NT4.2 NT5.2 U2.25(PAD) U3.25(PAD) U4.25(PAD) U5.25(PAD) U6.1(P3B) U6.2(HVC/A0) U6.5(VSS) U6.6(P1B) U6.11(P0B) U6.12(NC) U6.14(A1) U6.16(P2B) U6.21(EP)
~{E_EN}: R27.1 TP27.1 U5.23(~{ENABLE}) ; port ~{E_EN}
E_1A: J9.3 U5.18(OUT1A)
E_1B: J9.4 U5.15(OUT1B)
E_2A: J9.2 U5.19(OUT2A)
E_2B: J9.1 U5.22(OUT2B)
E_DIR: TP22.1 U5.14(DIR) ; port E_DIR
E_MS1: TP24.1 U5.5(MS1) ; port E_MS1
E_MS2: TP26.1 U5.6(MS2) ; port E_MS2
E_REF: C66.2 TP28.1 U5.12(REF) U6.20(P3W)
E_ROSC: R31.2 U5.8(ROSC)
E_SNS1: R30.2 U5.17(SENSE1)
E_SNS2: R29.2 U5.20(SENSE2)
E_STAR: C31.1 C33.1 C34.2 C62.1 NT5.1 R29.1 R30.1 R31.1 U5.13(GND) U5.24(GND)
E_STEP: TP25.1 U5.11(STEP) ; port E_STEP
SCL: R25.1 TP21.1 U6.3(SCL) ; port SCL
SDA: R24.1 TP23.1 U6.4(SDA) ; port SDA
~{X_EN}: R8.1 TP15.1 U2.23(~{ENABLE}) ; port ~{X_EN}
X_1A: J6.3 U2.18(OUT1A)
X_1B: J6.4 U2.15(OUT1B)
X_2A: J6.2 U2.19(OUT2A)
X_2B: J6.1 U2.22(OUT2B)
X_DIR: TP3.1 U2.14(DIR) ; port X_DIR
X_MS1: TP6.1 U2.5(MS1) ; port X_MS1
X_MS2: TP12.1 U2.6(MS2) ; port X_MS2
X_REF: C63.2 TP18.1 U2.12(REF) U6.10(P0W)
X_ROSC: R20.2 U2.8(ROSC)
X_SNS1: R15.2 U2.17(SENSE1)
X_SNS2: R14.2 U2.20(SENSE2)
X_STAR: C18.1 C24.1 C27.2 C59.1 NT2.1 R14.1 R15.1 R20.1 U2.13(GND) U2.24(GND)
X_STEP: TP9.1 U2.11(STEP) ; port X_STEP
~{Y_EN}: R10.1 TP16.1 U3.23(~{ENABLE}) ; port ~{Y_EN}
Y_1A: J7.3 U3.18(OUT1A)
Y_1B: J7.4 U3.15(OUT1B)
Y_2A: J7.2 U3.19(OUT2A)
Y_2B: J7.1 U3.22(OUT2B)
Y_DIR: TP4.1 U3.14(DIR) ; port Y_DIR
Y_MS1: TP7.1 U3.5(MS1) ; port Y_MS1
Y_MS2: TP13.1 U3.6(MS2) ; port Y_MS2
Y_REF: C64.2 TP19.1 U3.12(REF) U6.7(P1W)
Y_ROSC: R21.2 U3.8(ROSC)
Y_SNS1: R17.2 U3.17(SENSE1)
Y_SNS2: R16.2 U3.20(SENSE2)
Y_STAR: C20.1 C25.1 C28.2 C60.1 NT3.1 R16.1 R17.1 R21.1 U3.13(GND) U3.24(GND)
Y_STEP: TP10.1 U3.11(STEP) ; port Y_STEP
~{Z_EN}: R12.1 TP17.1 U4.23(~{ENABLE}) ; port ~{Z_EN}
Z_1A: J8.3 U4.18(OUT1A)
Z_1B: J8.4 U4.15(OUT1B)
Z_2A: J8.2 U4.19(OUT2A)
Z_2B: J8.1 U4.22(OUT2B)
Z_DIR: TP5.1 U4.14(DIR) ; port Z_DIR
Z_MS1: TP8.1 U4.5(MS1) ; port Z_MS1
Z_MS2: TP14.1 U4.6(MS2) ; port Z_MS2
Z_REF: C65.2 TP20.1 U4.12(REF) U6.17(P2W)
Z_ROSC: R22.2 U4.8(ROSC)
Z_SNS1: R19.2 U4.17(SENSE1)
Z_SNS2: R18.2 U4.20(SENSE2)
Z_STAR: C22.1 C26.1 C29.2 C61.1 NT4.1 R18.1 R19.1 R22.1 U4.13(GND) U4.24(GND)
Z_STEP: TP11.1 U4.11(STEP) ; port Z_STEP
NetC15_1: C15.1 U2.2(CP2)
NetC15_2: C15.2 U2.1(CP1)
NetC16_1: C16.1 U3.2(CP2)
NetC16_2: C16.2 U3.1(CP1)
NetC17_1: C17.1 U4.2(CP2)
NetC17_2: C17.2 U4.1(CP1)
NetC19_2: C19.2 U2.3(VCP)
NetC21_2: C21.2 U3.3(VCP)
NetC23_2: C23.2 U4.3(VCP)
NetC27_1: C27.1 U2.4(VREG)
NetC28_1: C28.1 U3.4(VREG)
NetC29_1: C29.1 U4.4(VREG)
NetC30_1: C30.1 U5.2(CP2)
NetC30_2: C30.2 U5.1(CP1)
NetC32_2: C32.2 U5.3(VCP)
NetC34_1: C34.1 U5.4(VREG)
NetR9_1: R9.1 U2.7(~{RESET}) U2.9(~{SLEEP})
NetR11_1: R11.1 U3.7(~{RESET}) U3.9(~{SLEEP})
NetR13_1: R13.1 U4.7(~{RESET}) U4.9(~{SLEEP})
NetR23_1: R23.1 U6.8(P1A) U6.9(P0A) U6.18(P2A) U6.19(P3A)
NetR26_1: R26.1 U6.13(~{RESET})
NetR28_1: R28.1 U5.7(~{RESET}) U5.9(~{SLEEP})

### Notes on the sheet
- X-AXIS STEPPER DRIVER
- Y-AXIS STEPPER DRIVER
- Z-AXIS STEPPER DRIVER
- EXTRUDER STEPPER DRIVER
- DIGI POT
- uSTEP SETTINGS
- (near C36) X/Y BULK CAP
- (near C37) Z/E BULK CAP
- PLACE CLOSE TO CORRESPONDING VBB PINS
- STEPPER BULK CAPS
- Based On:
- Title:
- Revision:
- Engineer:
- Drawn By:
- OS License:
- Checked:
- Date:
- Sheet:
- of
- Size:
- A4
- Design File Link:
- (in symbol NET_TIE) NT
- (in symbol TESTPOINT) TP

### Library data of the parts
C15-C17 C19 C21 C23-C26 C30 C32 C33 C35 = C0603-0.1UF-50V-10%-X7R: as C2 on sheet 5DPD8_v1.0_OS_Sheet1; Supplier 1: Digi-Key; RoHS: RoHS Compliant; Category: Capacitors; Stock 1: 2096000; Pricing 1: 4000=0.00513, 8000=0.00468, 12000=0.00446, 28000=0.00424, 100000=0.00307 (USD); Packaging: Tape & Reel (TR); Capacitance: 0.1µF; Voltage - Rated: 50V; Tolerance: ±10%; Temperature Coefficient: X7R; Mounting Type: Surface Mount, MLCC; Operating Temperature: -55°C ~ 125°C; Applications: General Purpose; Ratings: -; Package / Case: 0603 (1608 Metric); Size / Dimension: 0.063" L x 0.031" W (1.60mm x 0.80mm); Height - Seated (Max): -; Thickness (Max): 0.035" (0.90mm); Lead Spacing: -; Features: -; Lead Style: -; ComponentLink1URL: http://www.yageo.com/documents/recent/UPY-GPHC_X7R_6.3V-to-50V_8.pdf; ComponentLink1Description: http://www.yageo.com/documents/recent/UPY-GPHC_X7R_6.3V-to-50V_8.pdf; Supplier Part Number 1: 311-1344-2-ND
C18 C20 C22 C27-C29 C31 C34 = C0603-0.22UF-50V-10%-X7R: CAP CER 0.22UF 50V 10% X7R 0603; Manufacturer: TDK Corporation; ManufacturerPartNumber: C1608X7R1H224K080AB; Supplier 1: Digi-Key; RoHS: RoHS Compliant; Category: Capacitors; Stock 1: 116000; Pricing 1: 4000=0.03, 8000=0.0285, 12000=0.027, 28000=0.0255, 100000=0.02025 (USD); Packaging: Tape & Reel (TR); Capacitance: 0.22µF; Voltage - Rated: 50V; Tolerance: ±10%; Temperature Coefficient: X7R; Mounting Type: Surface Mount, MLCC; Operating Temperature: -55°C ~ 125°C; Applications: General Purpose; Ratings: -; Package / Case: 0603 (1608 Metric); Size / Dimension: 0.063" L x 0.031" W (1.60mm x 0.80mm); Height - Seated (Max): -; Thickness (Max): 0.035" (0.90mm); Lead Spacing: -; Features: -; Lead Style: -; ComponentLink1URL: http://product.tdk.com/capacitor/mlcc/en/documents/mlcc_commercial_general_en.pdf; ComponentLink1Description: http://product.tdk.com/capacitor/mlcc/en/documents/mlcc_commercial_general_en.pdf; Supplier Part Number 1: 445-7408-2-ND
C36 C37 = CAP_RAD-ALU-220UF-35V-20%: CAP ALUM 220UF 35V 20% RADIAL; Manufacturer: Rubycon; ManufacturerPartNumber: 35ZLH220MEFC8X11.5; Lifetime @ Temp.: 8000 Hrs @ 105°C; Ripple Current: 945mA; Impedance: 56 mOhm; Supplier 1: Digi-Key; RoHS: RoHS Compliant; Category: Capacitors; Stock 1: 40821; Pricing 1: 1=0.41, 10=0.288, 25=0.2456, 50=0.2176, 100=0.1895, 250=0.16148, 500=0.1404, 1000=0.11934, 2500=0.11232 (USD); Packaging: Bulk; Capacitance: 220µF; Voltage Rating: 35V; Tolerance: ±20%; ESR (Equivalent Series Resistance): -; Operating Temperature: -40°C ~ 105°C; Type: -; Applications: General Purpose; Lead Spacing: 0.138" (3.50mm); Size / Dimension: 0.315" Dia (8.00mm); Height - Seated (Max): 0.512" (13.00mm); Surface Mount Land Size: -; Mounting Type: Through Hole; Package / Case: Radial, Can; ComponentLink1URL: http://www.rubycon.co.jp/EN/CATALOG/E_PDFS/ALUMINUM/E_ZLH.PDF; ComponentLink1Description: http://www.rubycon.co.jp/EN/CATALOG/E_PDFS/ALUMINUM/E_ZLH.PDF; Supplier Part Number 1: 1189-1863-ND
C59-C62 = C0805-2.2UF-50V-10%-X7R: CAP CER 2.2UF 50V 10% X7R 0805; Manufacturer: Taiyo Yuden; ManufacturerPartNumber: UMK212BB7225KG-T; Supplier 1: Digi-Key; RoHS: RoHS Compliant; Category: Capacitors; Stock 1: 0; Pricing 1: 3000=0.05, 6000=0.04625, 9000=0.04375, 15000=0.0415, 30000=0.04, 75000=0.0375, 150000=0.03313 (USD); Packaging: Tape & Reel (TR); Capacitance: 2.2µF; Voltage - Rated: 50V; Tolerance: ±10%; Temperature Coefficient: X7R; Mounting Type: Surface Mount, MLCC; Operating Temperature: -55°C ~ 125°C; Applications: General Purpose; Ratings: -; Package / Case: 0805 (2012 Metric); Size / Dimension: 0.079" L x 0.049" W (2.00mm x 1.25mm); Height - Seated (Max): -; Thickness (Max): 0.057" (1.45mm); Lead Spacing: -; Features: -; Lead Style: -; Supplier Part Number 1: 587-3169-2-ND
C63-C66 = C0603-10NF-50V-10%-X7R: as C1 on sheet 5DPD8_v1.0_OS_Sheet1; Supplier 1: Digi-Key; RoHS: RoHS Compliant; Category: Capacitors; Stock 1: 15000; Pricing 1: 15000=0.003, 30000=0.00285, 75000=0.00255, 105000=0.00206 (USD); Packaging: Tape & Reel (TR); Capacitance: 10NF; Voltage - Rated: 50V; Tolerance: ±10%; Temperature Coefficient: X7R; Mounting Type: Surface Mount, MLCC; Operating Temperature: -55°C ~ 125°C; Applications: General Purpose; Ratings: -; Package / Case: 0603 (1608 Metric); Size / Dimension: 0.063" L x 0.031" W (1.60mm x 0.80mm); Height - Seated (Max): -; Thickness (Max): 0.035" (0.90mm); Lead Spacing: -; Features: -; Lead Style: -; ComponentLink1URL: http://www.yageo.com/documents/recent/UPY-GPHC_X7R_6.3V-to-50V_8.pdf; ComponentLink1Description: http://www.yageo.com/documents/recent/UPY-GPHC_X7R_6.3V-to-50V_8.pdf; Supplier Part Number 1: 311-1572-2-ND
J6-J9 = CON_MLX_22-27-2041: CONN HEADER 4POS .100 VERT TIN; Manufacturer: Molex Inc; Connector Type: Header, Unshrouded; Number of Positions: 4; Number of Positions Loaded: All; Pitch: 0.100" (2.54mm); Supplier 1: Digi-Key; ManufacturerPartNumber: 0022272041; RoHS: RoHS Compliant; Category: Connectors, Interconnects; Stock 1: 8074; Pricing 1: 1=0.42, 10=0.397, 25=0.3572, 50=0.3176, 100=0.3043, 250=0.27784, 500=0.2646, 1000=0.2183, 2500=0.19845 (USD); Packaging: Bulk; Contact Type: Male Pin; Number of Rows: 1; Row Spacing: -; Contact Mating Length: 0.295" (7.49mm); Mounting Type: Through Hole; Termination: Solder; Fastening Type: Friction Lock; Features: -; Contact Finish: Tin; Contact Finish Thickness: 100µin (2.54µm); Color: Natural; ComponentLink1URL: http://www.molex.com/pdm_docs/sd/022272041_sd.pdf; ComponentLink1Description: http://www.molex.com/pdm_docs/sd/022272041_sd.pdf; Supplier Part Number 1: WM4113-ND
NT2-NT5 = NET_TIE: NET TIE
R8-R13 R26-R28 = R0603-10K-0.1W-5%: as R1 on sheet 5DPD8_v1.0_OS_Sheet1; Supplier 1: Digi-Key; RoHS: RoHS Compliant; Category: Resistors; Stock 1: 0; Pricing 1: 5000=0.00131, 10000=0.00114, 25000=0.001, 50000=0.00092, 125000=0.0009 (USD); Packaging: Tape & Reel (TR); Resistance: 10K; Tolerance: ±5%; Composition: Thick Film; Features: -; Package / Case: 0603 (1608 Metric); Supplier Device Package: 0603; Size / Dimension: 0.063" L x 0.031" W (1.60mm x 0.80mm); Height: 0.022" (0.55mm); Number of Terminations: 2; ComponentLink1URL: http://www.yageo.com/documents/recent/PYu-RC0603_51_RoHS_L_4.pdf; ComponentLink1Description: http://www.yageo.com/documents/recent/PYu-RC0603_51_RoHS_L_4.pdf; Supplier Part Number 1: 311-10KGRTR-ND
R14-R19 R29 R30 = R0805-0R1-0.5W-1%: RES 0.100 OHM 0.5W 1% 0805; Manufacturer: Susumu; ManufacturerPartNumber: KRL1220E-M-R100-F-T5; Power (Watts): 0.5W, 1/2W; Temperature Coefficient: ±50ppm/°C; Supplier 1: Digi-Key; RoHS: RoHS Compliant; Category: Resistors; Stock 1: 5000; Pricing 1: 5000=0.07965, 10000=0.07788, 25000=0.07523, 50000=0.07375, 125000=0.07304 (USD); Packaging: Tape & Reel (TR); Resistance: 0R1; Tolerance: ±1%; Composition: Metal Foil; Features: Current Sense; Package / Case: 0805 (2012 Metric); Supplier Device Package: 0805; Size / Dimension: 0.079" L x 0.049" W (2.00mm x 1.25mm); Height: 0.028" (0.70mm); Number of Terminations: 2; ComponentLink1URL: http://susumu-usa.com/pdf/KRL_New_Short_Data_sheet.pdf; ComponentLink1Description: http://susumu-usa.com/pdf/KRL_New_Short_Data_sheet.pdf; Supplier Part Number 1: 408-1556-2-ND
R20-R22 R31 = R0603-0R-0.1W-JUMP: as R5 on sheet 5DPD8_v1.0_OS_Sheet1; Supplier 1: Digi-Key; RoHS: RoHS Compliant; Category: Resistors; Stock 1: 2065000; Pricing 1: 5000=0.00131, 10000=0.00114, 25000=0.001, 50000=0.00092, 125000=0.0009 (USD); Packaging: Tape & Reel (TR); Resistance: 0R; Composition: Thick Film; Features: -; Temperature Coefficient: -; Package / Case: 0603 (1608 Metric); Supplier Device Package: 0603; Size / Dimension: 0.063" L x 0.031" W (1.60mm x 0.80mm); Height: 0.022" (0.55mm); Number of Terminations: 2; ComponentLink1URL: http://www.yageo.com/documents/recent/PYu-RC0603_51_RoHS_L_4.pdf; ComponentLink1Description: http://www.yageo.com/documents/recent/PYu-RC0603_51_RoHS_L_4.pdf; Supplier Part Number 1: 311-0.0GRTR-ND
R23 = R0603-4K7-0.1W-1%: RES 4.70K OHM 1/10W 1% 0603 SMD; Manufacturer: Yageo; ManufacturerPartNumber: RC0603FR-074K7L; Power (Watts): 0.1W, 1/10W; Temperature Coefficient: ±100ppm/°C; Supplier 1: Digi-Key; RoHS: RoHS Compliant; Category: Resistors; Stock 1: 0; Pricing 1: 5000=0.00171, 10000=0.00149, 25000=0.00131, 50000=0.0012, 125000=0.00117 (USD); Packaging: Tape & Reel (TR); Resistance: 4K7; Tolerance: ±1%; Composition: Thick Film; Features: -; Package / Case: 0603 (1608 Metric); Supplier Device Package: 0603; Size / Dimension: 0.063" L x 0.031" W (1.60mm x 0.80mm); Height: 0.022" (0.55mm); Number of Terminations: 2; ComponentLink1URL: http://www.yageo.com/documents/recent/PYu-RC0603_51_RoHS_L_4.pdf; ComponentLink1Description: http://www.yageo.com/documents/recent/PYu-RC0603_51_RoHS_L_4.pdf; Supplier Part Number 1: 311-4.70KHRTR-ND
R24 R25 = R0603-2K2-0.1W-5%: RES 2.2K OHM 1/10W 5% 0603 SMD; Manufacturer: Yageo; ManufacturerPartNumber: RC0603JR-072K2L; Power (Watts): 0.1W, 1/10W; Temperature Coefficient: ±100ppm/°C; Supplier 1: Digi-Key; RoHS: RoHS Compliant; Category: Resistors; Stock 1: 480000; Pricing 1: 5000=0.00131, 10000=0.00114, 25000=0.001, 50000=0.00092, 125000=0.0009 (USD); Packaging: Tape & Reel (TR); Resistance: 2K2; Tolerance: ±5%; Composition: Thick Film; Features: -; Package / Case: 0603 (1608 Metric); Supplier Device Package: 0603; Size / Dimension: 0.063" L x 0.031" W (1.60mm x 0.80mm); Height: 0.022" (0.55mm); Number of Terminations: 2; ComponentLink1URL: http://www.yageo.com/documents/recent/PYu-RC0603_51_RoHS_L_4.pdf; ComponentLink1Description: http://www.yageo.com/documents/recent/PYu-RC0603_51_RoHS_L_4.pdf; Supplier Part Number 1: 311-2.2KGRTR-ND
U2-U5 = IC_A4982SLPTR-T: IC MOTOR DRIVER PAR 24TSSOP; Manufacturer: Allegro MicroSystems, LLC; Motor Type - Stepper: Bipolar; Motor Type - AC, DC: Brushed DC; Function: Driver - Fully Integrated, Control and Power Stage; Output Configuration: Full H-Bridge, (2) Dual; Interface: Parallel; Current - Output: 2A; Voltage - Supply: 3 V ~ 5.5 V; Voltage - Load: 8 V ~ 35 V; Supplier 1: Digi-Key; ManufacturerPartNumber: A4982SLPTR-T; RoHS: RoHS Compliant; Category: Integrated Circuits (ICs); Stock 1: 4000; Pricing 1: 4000=1.6891, 8000=1.6256, 12000=1.5748, 28000=1.524 (USD); Packaging: Tape & Reel (TR); Applications: General Purpose; Operating Temperature: -20°C ~ 85°C; Mounting Type: Surface Mount; Package / Case: 24-TSSOP (0.173", 4.40mm Width) Exposed Pad; Supplier Device Package: 24-TSSOP-EP; ComponentLink1URL: http://www.allegromicro.com/en/Products/Part_Numbers/4982/4982.pdf; ComponentLink1Description: http://www.allegromicro.com/en/Products/Part_Numbers/4982/4982.pdf; Supplier Part Number 1: 620-1352-2-ND
U6 = IC_MCP4451-103E/ML: IC POT 10K QUAD 8BIT 20QFN; Manufacturer: Microchip Technology; Taps: 257; Number of Circuits: 4; Temperature Coefficient: 150 ppm/°C Typical; Memory Type: Volatile; Interface: I²C (Device Address); Voltage - Supply: 1.8 V ~ 5.5 V; Supplier 1: Digi-Key; ManufacturerPartNumber: MCP4451-103E/ML; RoHS: RoHS Compliant; Category: Integrated Circuits (ICs); Stock 1: 55; Pricing 1: 1=1.62, 10=1.35, 25=1.13, 100=1.02 (USD); Packaging: Tube; Operating Temperature: -40°C ~ 125°C; Mounting Type: Surface Mount; Package / Case: 20-VFQFN Exposed Pad; Supplier Device Package: 20-QFN (4x4); ComponentLink1URL: http://www.microchip.com/mymicrochip/filehandler.aspx?ddocname=en551975; ComponentLink1Description: http://www.microchip.com/mymicrochip/filehandler.aspx?ddocname=en551975; Supplier Part Number 1: MCP4451-103E/ML-ND; Resistance: 10K